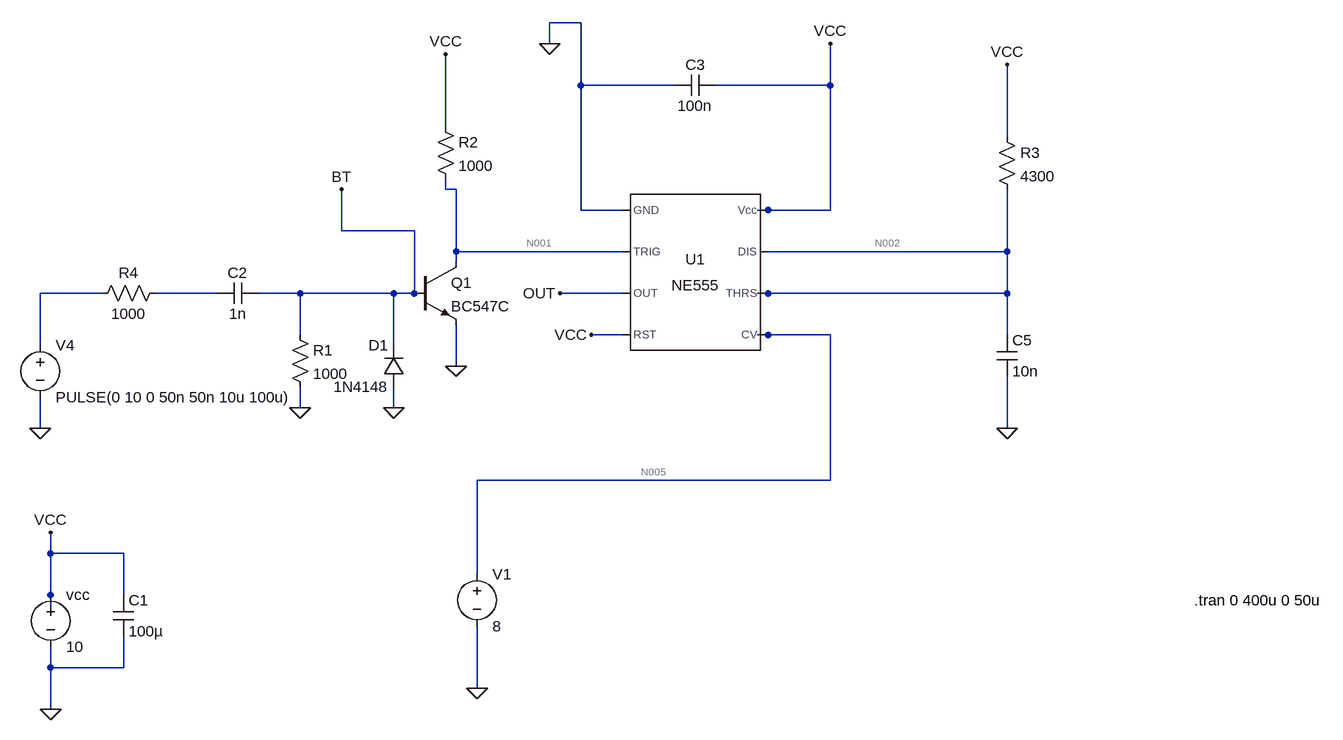
[diagram p0: schematic 555.asc]
555.asc, the LTspice schematic file:
Version 4
SHEET 1 1944 1268
WIRE 416 -288 368 -288
WIRE 368 -256 368 -288
WIRE 416 -192 416 -288
WIRE 560 -192 416 -192
WIRE 800 -192 800 -256
WIRE 800 -192 624 -192
WIRE 208 -128 208 -240
WIRE 1072 -112 1072 -224
WIRE 208 -32 208 -48
WIRE 224 -32 208 -32
WIRE 416 0 416 -192
WIRE 480 0 416 0
WIRE 704 0 688 0
WIRE 800 0 800 -192
WIRE 800 0 704 0
WIRE 48 32 48 -32
WIRE 160 32 48 32
WIRE 224 64 224 -32
WIRE 480 64 224 64
WIRE 1072 64 1072 -32
WIRE 1072 64 704 64
WIRE 224 80 224 64
WIRE -320 128 -416 128
WIRE -144 128 -240 128
WIRE -16 128 -80 128
WIRE 128 128 -16 128
WIRE 160 128 160 32
WIRE 160 128 128 128
WIRE 480 128 384 128
WIRE 704 128 688 128
WIRE 1072 128 1072 64
WIRE 1072 128 704 128
WIRE -16 192 -16 128
WIRE 480 192 432 192
WIRE 704 192 688 192
WIRE 800 192 704 192
WIRE 1072 192 1072 128
WIRE -416 208 -416 128
WIRE 128 208 128 128
WIRE 224 240 224 176
WIRE -16 304 -16 272
WIRE 128 304 128 272
WIRE -416 336 -416 288
WIRE 1072 336 1072 256
WIRE 800 416 800 192
WIRE 800 416 256 416
WIRE -400 528 -400 496
WIRE -288 528 -400 528
WIRE 256 560 256 416
WIRE -400 592 -400 528
WIRE -288 592 -288 528
WIRE -400 624 -400 592
WIRE -400 704 -400 672
WIRE -288 704 -288 656
WIRE -288 704 -400 704
WIRE 256 736 256 640
WIRE -400 768 -400 704
FLAG -400 768 0
FLAG -416 336 0
FLAG -16 304 0
FLAG 128 304 0
FLAG 224 240 0
FLAG -400 496 VCC
FLAG 368 -256 0
FLAG 800 -256 VCC
FLAG 208 -240 VCC
FLAG 1072 -224 VCC
FLAG 1072 336 0
FLAG 384 128 OUT
FLAG 432 192 VCC
FLAG 256 736 0
FLAG 48 -32 BT
SYMBOL Misc\\NE555 592 96 R0
SYMATTR InstName U1
SYMBOL voltage -400 576 R0
WINDOW 123 0 0 Left 0
WINDOW 39 0 0 Left 0
SYMATTR InstName vcc
SYMATTR Value 10
SYMBOL voltage -416 192 R0
WINDOW 123 24 124 Left 2
WINDOW 39 0 0 Left 0
SYMATTR InstName V4
SYMATTR Value PULSE(0 10 0 50n 50n 10u 100u)
SYMBOL cap -304 592 R0
SYMATTR InstName C1
SYMATTR Value 100µ
SYMBOL cap -80 112 R90
WINDOW 0 0 32 VBottom 2
WINDOW 3 32 32 VTop 2
SYMATTR InstName C2
SYMATTR Value 1n
SYMBOL cap 624 -208 R90
WINDOW 0 0 32 VBottom 2
WINDOW 3 32 32 VTop 2
SYMATTR InstName C3
SYMATTR Value 100n
SYMBOL res -32 176 R0
SYMATTR InstName R1
SYMATTR Value 1000
SYMBOL res 192 -144 R0
SYMATTR InstName R2
SYMATTR Value 1000
SYMBOL res 1056 -128 R0
SYMATTR InstName R3
SYMATTR Value 4300
SYMBOL res -224 112 R90
WINDOW 0 0 56 VBottom 2
WINDOW 3 32 56 VTop 2
SYMATTR InstName R4
SYMATTR Value 1000
SYMBOL diode 144 272 R180
WINDOW 0 24 64 Left 2
WINDOW 3 24 0 Left 2
SYMATTR InstName D1
SYMATTR Value 1N4148
SYMBOL npn 160 80 R0
SYMATTR InstName Q1
SYMATTR Value BC547C
SYMBOL cap 1056 192 R0
SYMATTR InstName C5
SYMATTR Value 10n
SYMBOL voltage 256 544 R0
WINDOW 123 0 0 Left 0
WINDOW 39 0 0 Left 0
SYMATTR InstName V1
SYMATTR Value 8
TEXT 1360 600 Left 2 !.tran 0 400u 0 50u

The netlist it stands for:
* 555.asc
XU1 0 N001 OUT VCC N005 N002 N002 VCC NE555  ; pins GND TRIG OUT RST CV THRS DIS Vcc
vcc VCC 0 10
V4 N003 0 PULSE(0 10 0 50n 50n 10u 100u)
C1 VCC 0 100µ
C2 BT N004 1n
C3 VCC 0 100n
R1 BT 0 1000
R2 VCC N001 1000
R3 VCC N002 4300
R4 N004 N003 1000
D1 0 BT 1N4148
Q1 N001 BT 0 0 BC547C
C5 N002 0 10n
V1 N005 0 8
.model D D
.lib standard.dio
.model NPN NPN
.model PNP PNP
.lib standard.bjt
.tran 0 400u 0 50u
.lib NE555.sub
.backanno
.end

* Results of the author's LTspice run, read from the files saved beside the schematic
* Operating Point, zero values left out:
*   V(n001) = 10 V
*   V(n005) = 8 V
*   V(vcc) = 10 V
*   V(n002) = 10 V
*   V(out) = 10 V
*   V(bt) = 10.03 nV
*   Ic(Q1) = 10.08 pA
*   Ib(Q1) = -10.03 pA
*   I(R3) = 23.34 nA
*   I(R2) = 10.01 nA
*   I(R1) = 10.03 pA
*   I(V1) = -400 µA
*   I(Vcc) = -2.966 mA
*   Ix(u1:1) = -3.366 mA
*   Ix(u1:2) = 10 nA
*   Ix(u1:4) = 56 µA
*   Ix(u1:5) = 400 µA
*   Ix(u1:6) = 10 nA
*   Ix(u1:7) = 13.34 nA
*   Ix(u1:8) = 2.91 mA
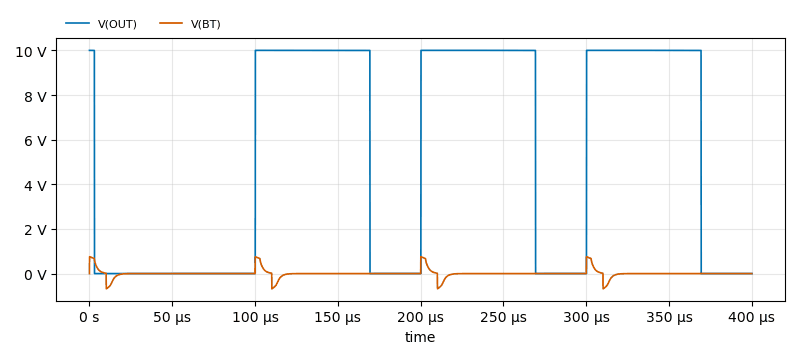
[diagram p1: Transient Analysis of 555.asc, plotted from the saved traces]
* Transient Analysis, 1 run:
*   V(OUT): min 60 µV, max 10 V, average 5.264 V, rms 7.255 V, last 60 µV
*   V(BT): min -681.9 mV, max 755.9 mV, average 4.874 mV, rms 178.7 mV, last 0 V